# EAGLE schematic Light2021 (EAGLE 9.6.2)
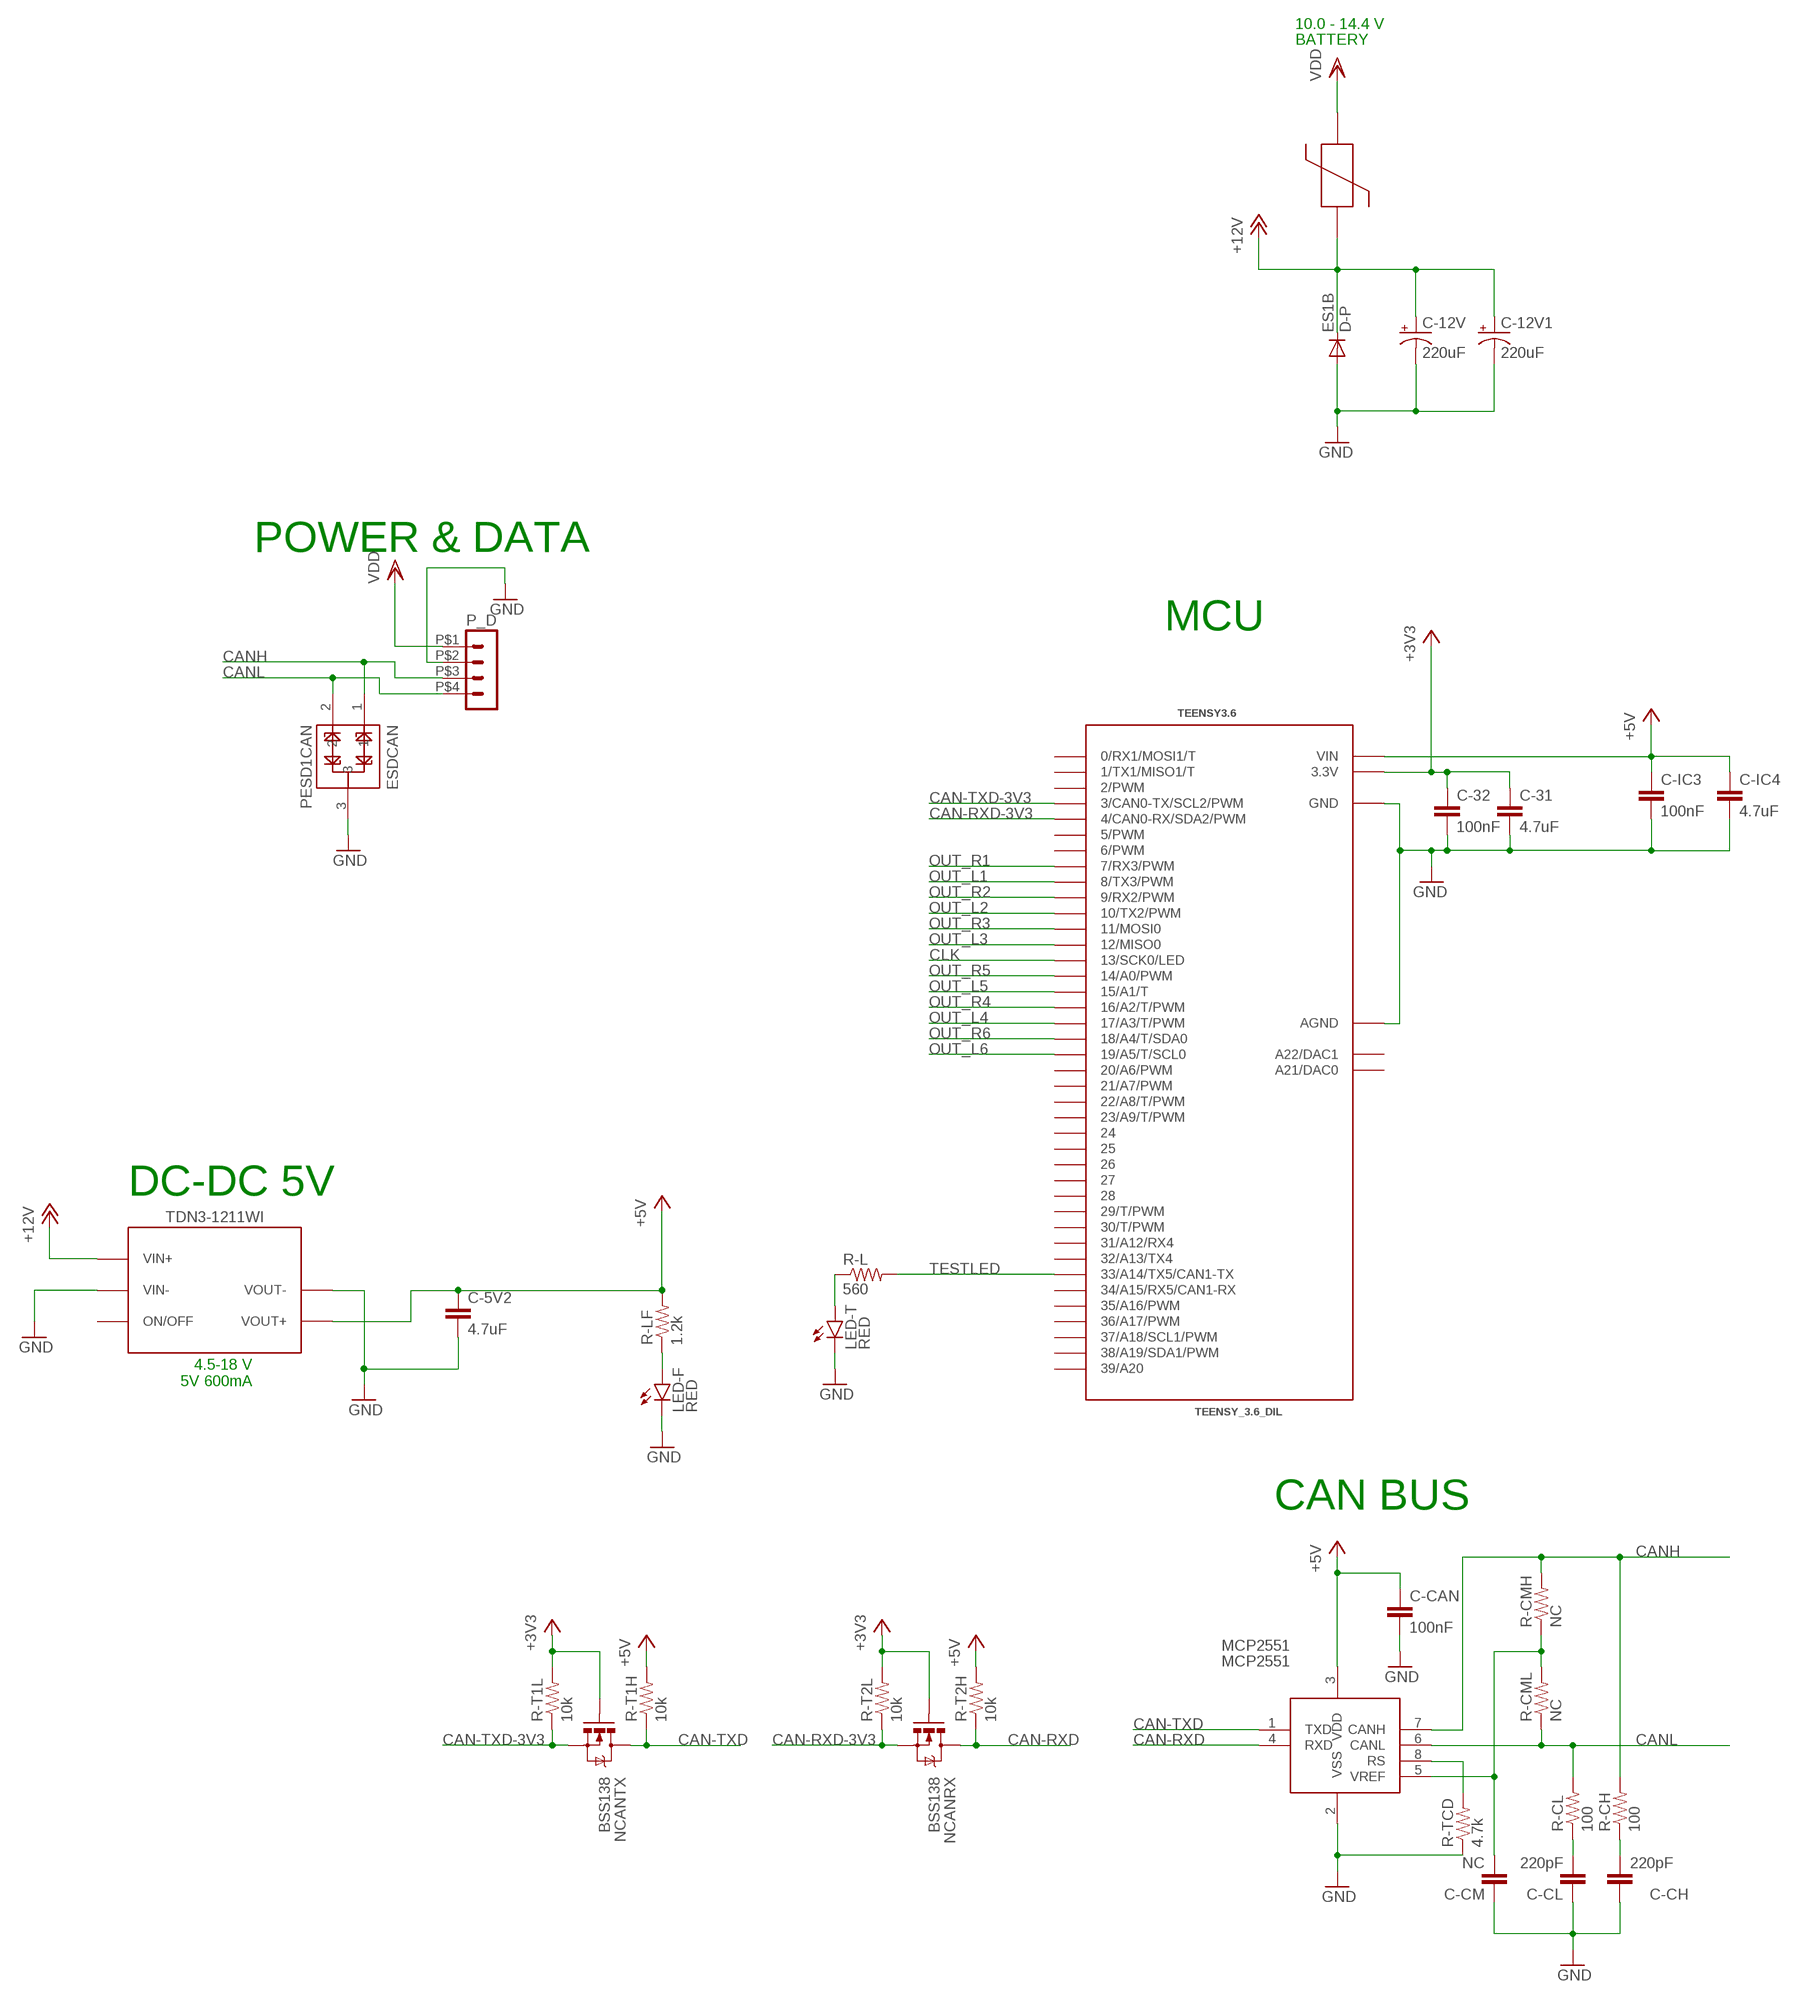
[diagram p0: schematic, sheet 1, part 1 of 2]
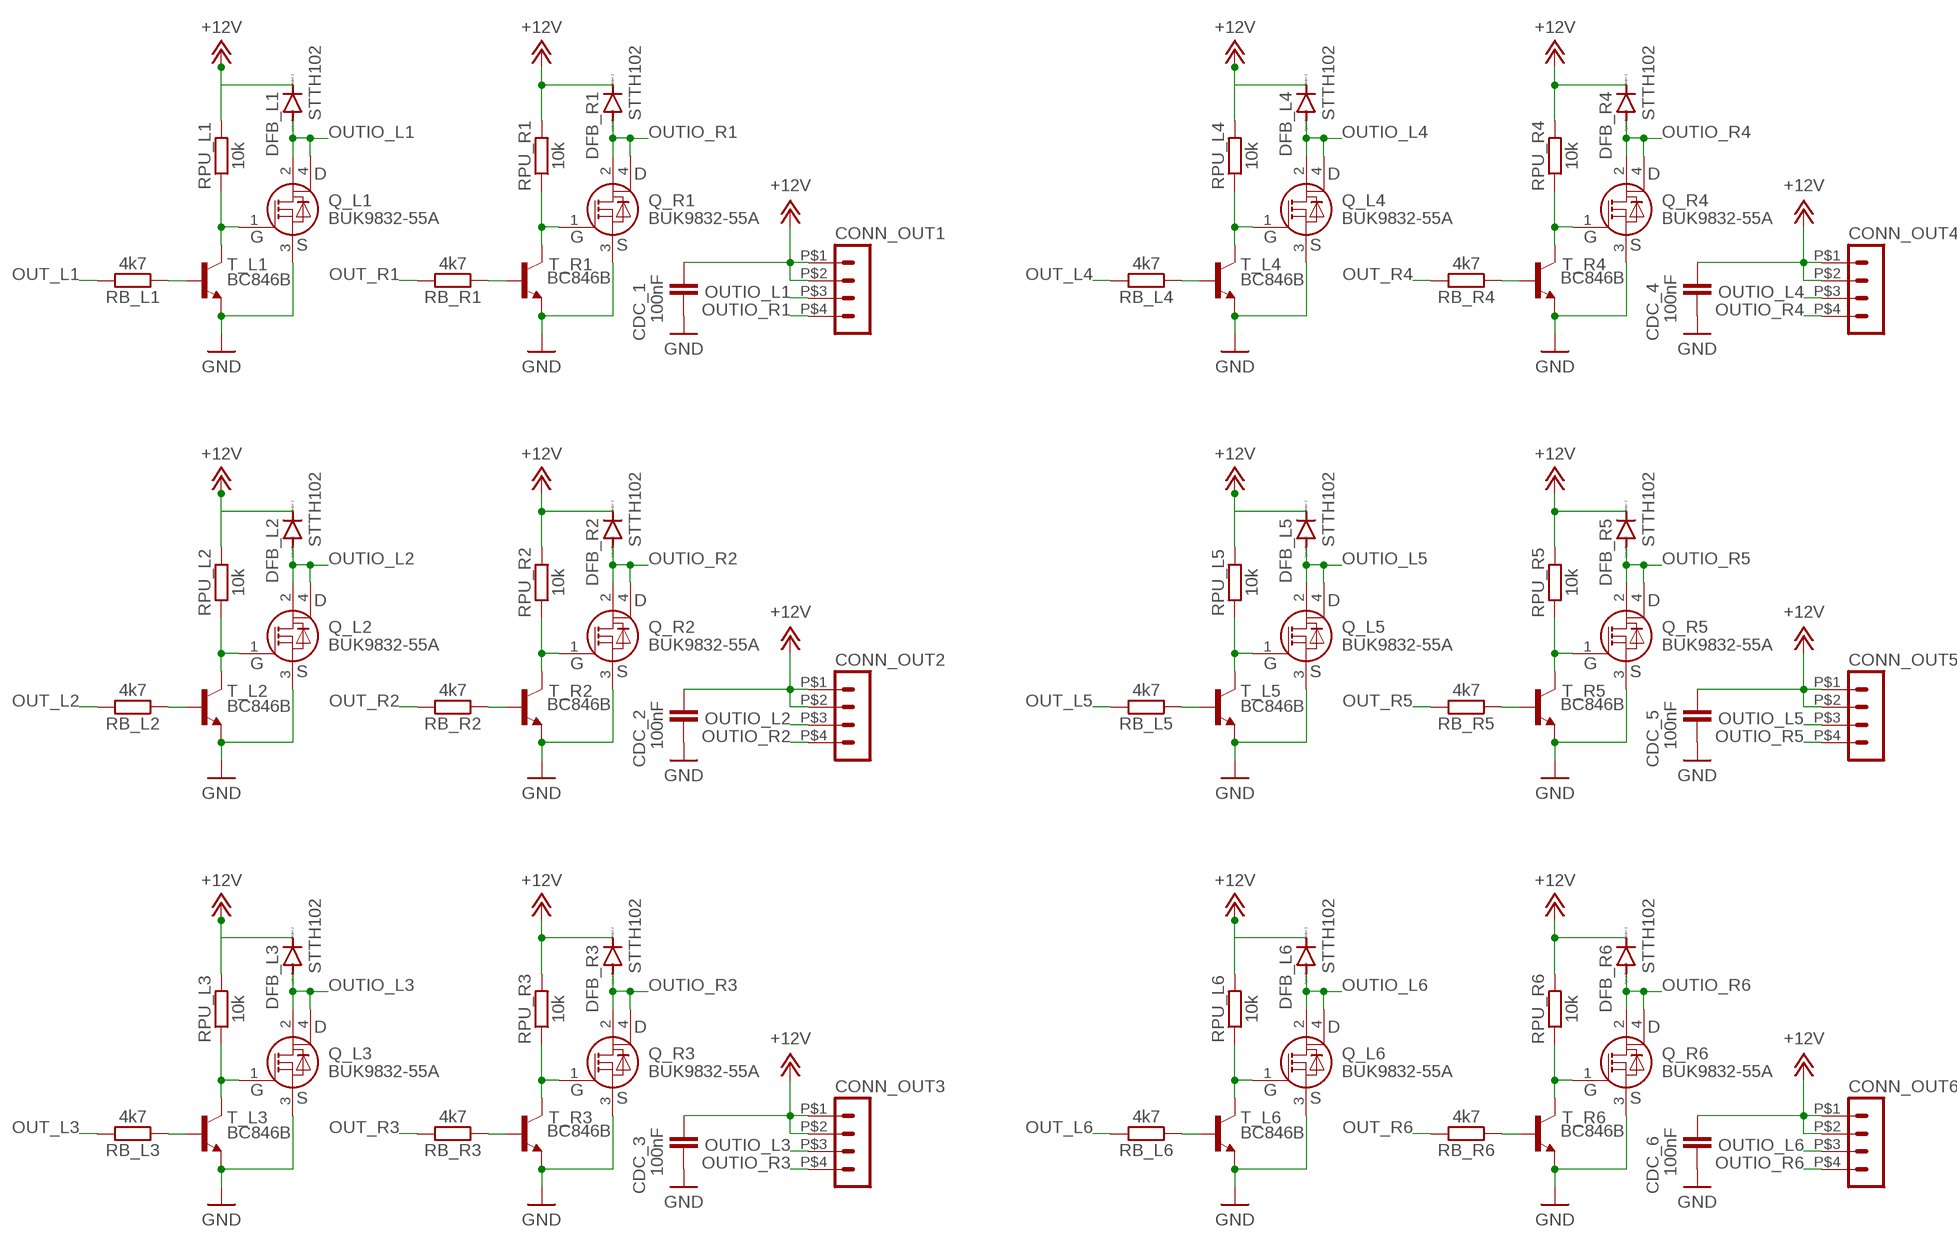
[diagram p1: schematic, sheet 1, part 2 of 2]

## Parts
C-5V2  4.7uF  CAP1210  [1210]
C-12V  220uF  CPOL-USD  [PANASONIC_D]
C-12V1  220uF  CPOL-USD  [PANASONIC_D]
C-31  4.7uF  CAP1210  [1210]
C-32  100nF  CAP0805  [0805]
C-CAN  100nF  CAP0805  [0805]
C-CH  220pF  CAP0805  [0805]
C-CL  220pF  CAP0805  [0805]
C-CM  NC  CAP0805  [0805]
C-IC3  100nF  CAP0805  [0805]
C-IC4  4.7uF  CAP1210  [1210]
CDC_1  100nF  CAP0805  [0805]
CDC_2  100nF  CAP0805  [0805]
CDC_3  100nF  CAP0805  [0805]
CDC_4  100nF  CAP0805  [0805]
CDC_5  100nF  CAP0805  [0805]
CDC_6  100nF  CAP0805  [0805]
CONN_OUT1  HEADER_POS4_43045-0401  [43045-0400]
CONN_OUT2  HEADER_POS4_43045-0401  [43045-0400]
CONN_OUT3  HEADER_POS4_43045-0401  [43045-0400]
CONN_OUT4  HEADER_POS4_43045-0401  [43045-0400]
CONN_OUT5  HEADER_POS4_43045-0401  [43045-0400]
CONN_OUT6  HEADER_POS4_43045-0401  [43045-0400]
D-P  ES1B  DIODESMA  [SMA-DIODE]
DFB_L1  STTH102  DIODE-DO214AC  [DO214AC]
DFB_L2  STTH102  DIODE-DO214AC  [DO214AC]
DFB_L3  STTH102  DIODE-DO214AC  [DO214AC]
DFB_L4  STTH102  DIODE-DO214AC  [DO214AC]
DFB_L5  STTH102  DIODE-DO214AC  [DO214AC]
DFB_L6  STTH102  DIODE-DO214AC  [DO214AC]
DFB_R1  STTH102  DIODE-DO214AC  [DO214AC]
DFB_R2  STTH102  DIODE-DO214AC  [DO214AC]
DFB_R3  STTH102  DIODE-DO214AC  [DO214AC]
DFB_R4  STTH102  DIODE-DO214AC  [DO214AC]
DFB_R5  STTH102  DIODE-DO214AC  [DO214AC]
DFB_R6  STTH102  DIODE-DO214AC  [DO214AC]
ESDCAN  PESD1CAN  [SOT23-3]
LED-F  RED  LED1206  [LED-1206]
LED-T  RED  LED1206  [LED-1206]
MAIN_FUSE  SMF_OMNI-BLOK_FUSE_BLOCK  [SMF_OMNI-BLOK_FUSE_BLOCK]
MCP2551  MCP2551  [SO-08M]
NCANRX  BSS138  MOSFET-NCHANNELBSS123LT1G  [SOT23]
NCANTX  BSS138  MOSFET-NCHANNELBSS123LT1G  [SOT23]
P_D  HEADER_POS4_43045-0401  [43045-0400]
Q_L1  BUK9832-55A  [SOT230P700X180-4N]
Q_L2  BUK9832-55A  [SOT230P700X180-4N]
Q_L3  BUK9832-55A  [SOT230P700X180-4N]
Q_L4  BUK9832-55A  [SOT230P700X180-4N]
Q_L5  BUK9832-55A  [SOT230P700X180-4N]
Q_L6  BUK9832-55A  [SOT230P700X180-4N]
Q_R1  BUK9832-55A  [SOT230P700X180-4N]
Q_R2  BUK9832-55A  [SOT230P700X180-4N]
Q_R3  BUK9832-55A  [SOT230P700X180-4N]
Q_R4  BUK9832-55A  [SOT230P700X180-4N]
Q_R5  BUK9832-55A  [SOT230P700X180-4N]
Q_R6  BUK9832-55A  [SOT230P700X180-4N]
R-CH  100  RESISTOR0805  [0805]
R-CL  100  RESISTOR0805  [0805]
R-CMH  NC  RESISTOR0805  [0805]
R-CML  NC  RESISTOR0805  [0805]
R-L  560  RESISTOR0805  [0805]
R-LF  1.2k  RESISTOR0805  [0805]
R-T1H  10k  RESISTOR0805  [0805]
R-T1L  10k  RESISTOR0805  [0805]
R-T2H  10k  RESISTOR0805  [0805]
R-T2L  10k  RESISTOR0805  [0805]
R-TCD  4.7k  RESISTOR0805  [0805]
RB_L1  4k7  R-EU_R0805  [R0805]
RB_L2  4k7  R-EU_R0805  [R0805]
RB_L3  4k7  R-EU_R0805  [R0805]
RB_L4  4k7  R-EU_R0805  [R0805]
RB_L5  4k7  R-EU_R0805  [R0805]
RB_L6  4k7  R-EU_R0805  [R0805]
RB_R1  4k7  R-EU_R0805  [R0805]
RB_R2  4k7  R-EU_R0805  [R0805]
RB_R3  4k7  R-EU_R0805  [R0805]
RB_R4  4k7  R-EU_R0805  [R0805]
RB_R5  4k7  R-EU_R0805  [R0805]
RB_R6  4k7  R-EU_R0805  [R0805]
RPU_L1  10k  R-EU_R0805  [R0805]
RPU_L2  10k  R-EU_R0805  [R0805]
RPU_L3  10k  R-EU_R0805  [R0805]
RPU_L4  10k  R-EU_R0805  [R0805]
RPU_L5  10k  R-EU_R0805  [R0805]
RPU_L6  10k  R-EU_R0805  [R0805]
RPU_R1  10k  R-EU_R0805  [R0805]
RPU_R2  10k  R-EU_R0805  [R0805]
RPU_R3  10k  R-EU_R0805  [R0805]
RPU_R4  10k  R-EU_R0805  [R0805]
RPU_R5  10k  R-EU_R0805  [R0805]
RPU_R6  10k  R-EU_R0805  [R0805]
T_L1  BC846B  BC846B-NPN-SOT23-BEC  [SOT23-BEC]
T_L2  BC846B  BC846B-NPN-SOT23-BEC  [SOT23-BEC]
T_L3  BC846B  BC846B-NPN-SOT23-BEC  [SOT23-BEC]
T_L4  BC846B  BC846B-NPN-SOT23-BEC  [SOT23-BEC]
T_L5  BC846B  BC846B-NPN-SOT23-BEC  [SOT23-BEC]
T_L6  BC846B  BC846B-NPN-SOT23-BEC  [SOT23-BEC]
T_R1  BC846B  BC846B-NPN-SOT23-BEC  [SOT23-BEC]
T_R2  BC846B  BC846B-NPN-SOT23-BEC  [SOT23-BEC]
T_R3  BC846B  BC846B-NPN-SOT23-BEC  [SOT23-BEC]
T_R4  BC846B  BC846B-NPN-SOT23-BEC  [SOT23-BEC]
T_R5  BC846B  BC846B-NPN-SOT23-BEC  [SOT23-BEC]
T_R6  BC846B  BC846B-NPN-SOT23-BEC  [SOT23-BEC]
TDN3-1211WI  TDN3WI  [TDC3WI]
TEENSY3.6  TEENSY_3.6_DIL  [TEENSY_3.6_DIL]

## Nets
+3V3: C-31.1 C-32.1 NCANRX.1(G) NCANTX.1(G) R-T1L.2 R-T2L.2 TEENSY3.6.3.3V1(3.3V) TEENSY3.6.3.3V2(3.3V)
+5V: C-5V2.1 C-CAN.1 C-IC3.1 C-IC4.1 MCP2551.3(VDD) R-LF.2 R-T1H.2 R-T2H.2 TDN3-1211WI.VOUT+ TEENSY3.6.VIN
+12V: C-12V1.+ C-12V.+ CDC_1.1 CDC_2.1 CDC_3.1 CDC_4.1 CDC_5.1 CDC_6.1 CONN_OUT1.P$1 CONN_OUT1.P$2 CONN_OUT2.P$1 CONN_OUT2.P$2 CONN_OUT3.P$1 CONN_OUT3.P$2 CONN_OUT4.P$1 CONN_OUT4.P$2 CONN_OUT5.P$1 CONN_OUT5.P$2 CONN_OUT6.P$1 CONN_OUT6.P$2 D-P.C DFB_L1.C DFB_L2.C DFB_L3.C DFB_L4.C DFB_L5.C DFB_L6.C DFB_R1.C DFB_R2.C DFB_R3.C DFB_R4.C DFB_R5.C DFB_R6.C MAIN_FUSE.PIN1 RPU_L1.2 RPU_L2.2 RPU_L3.2 RPU_L4.2 RPU_L5.2 RPU_L6.2 RPU_R1.2 RPU_R2.2 RPU_R3.2 RPU_R4.2 RPU_R5.2 RPU_R6.2 TDN3-1211WI.VIN+
CAN-RXD: MCP2551.4(RXD) NCANRX.3(D) R-T2H.1
CAN-RXD-3V3: NCANRX.2(S) R-T2L.1 TEENSY3.6.4(4/CAN0-RX/SDA2/PWM)
CAN-TXD: MCP2551.1(TXD) NCANTX.3(D) R-T1H.1
CAN-TXD-3V3: NCANTX.2(S) R-T1L.1 TEENSY3.6.3(3/CAN0-TX/SCL2/PWM)
CANH [diff_pairs]: ESDCAN.1 MCP2551.7(CANH) P_D.P$3 R-CH.2 R-CMH.2
CANL [diff_pairs]: ESDCAN.2 MCP2551.6(CANL) P_D.P$4 R-CL.2 R-CML.1
CLK: TEENSY3.6.13(13/SCK0/LED)
GND: C-5V2.2 C-12V1.- C-12V.- C-31.2 C-32.2 C-CAN.2 C-CH.1 C-CL.1 C-CM.1 C-IC3.2 C-IC4.2 CDC_1.2 CDC_2.2 CDC_3.2 CDC_4.2 CDC_5.2 CDC_6.2 D-P.A ESDCAN.3 LED-F.C LED-T.C MCP2551.2(VSS) P_D.P$2 Q_L1.3(S) Q_L2.3(S) Q_L3.3(S) Q_L4.3(S) Q_L5.3(S) Q_L6.3(S) Q_R1.3(S) Q_R2.3(S) Q_R3.3(S) Q_R4.3(S) Q_R5.3(S) Q_R6.3(S) R-TCD.1 T_L1.E T_L2.E T_L3.E T_L4.E T_L5.E T_L6.E T_R1.E T_R2.E T_R3.E T_R4.E T_R5.E T_R6.E TDN3-1211WI.VIN- TDN3-1211WI.VOUT- TEENSY3.6.AGND TEENSY3.6.GND TEENSY3.6.GND1(GND)
N$1: LED-T.A R-L.1
N$6: C-CM.2 MCP2551.5(VREF) R-CMH.1 R-CML.2
N$7: RB_L1.1 T_L1.B
N$8: Q_L1.1(G) RPU_L1.1 T_L1.C
N$9: RB_R1.1 T_R1.B
N$10: Q_R1.1(G) RPU_R1.1 T_R1.C
N$11: RB_L2.1 T_L2.B
N$12: LED-F.A R-LF.1
N$13: Q_L2.1(G) RPU_L2.1 T_L2.C
N$14: RB_R2.1 T_R2.B
N$15: Q_R2.1(G) RPU_R2.1 T_R2.C
N$16: RB_L3.1 T_L3.B
N$17: Q_L3.1(G) RPU_L3.1 T_L3.C
N$18: RB_R3.1 T_R3.B
N$19: Q_R3.1(G) RPU_R3.1 T_R3.C
N$24: RB_L4.1 T_L4.B
N$25: C-CL.2 R-CL.1
N$26: C-CH.2 R-CH.1
N$27: Q_L4.1(G) RPU_L4.1 T_L4.C
N$28: RB_R4.1 T_R4.B
N$29: Q_R4.1(G) RPU_R4.1 T_R4.C
N$34: RB_L5.1 T_L5.B
N$35: Q_L5.1(G) RPU_L5.1 T_L5.C
N$36: RB_R5.1 T_R5.B
N$37: Q_R5.1(G) RPU_R5.1 T_R5.C
N$42: RB_L6.1 T_L6.B
N$43: Q_L6.1(G) RPU_L6.1 T_L6.C
N$44: RB_R6.1 T_R6.B
N$45: Q_R6.1(G) RPU_R6.1 T_R6.C
OUT_L1: RB_L1.2 TEENSY3.6.8(8/TX3/PWM)
OUT_L2: RB_L2.2 TEENSY3.6.10(10/TX2/PWM)
OUT_L3: RB_L3.2 TEENSY3.6.12(12/MISO0)
OUT_L4: RB_L4.2 TEENSY3.6.17/A3(17/A3/T/PWM)
OUT_L5: RB_L5.2 TEENSY3.6.15/A1(15/A1/T)
OUT_L6: RB_L6.2 TEENSY3.6.19/A5(19/A5/T/SCL0)
OUT_R1: RB_R1.2 TEENSY3.6.7(7/RX3/PWM)
OUT_R2: RB_R2.2 TEENSY3.6.9(9/RX2/PWM)
OUT_R3: RB_R3.2 TEENSY3.6.11(11/MOSI0)
OUT_R4: RB_R4.2 TEENSY3.6.16/A2(16/A2/T/PWM)
OUT_R5: RB_R5.2 TEENSY3.6.14/A0(14/A0/PWM)
OUT_R6: RB_R6.2 TEENSY3.6.18/A4(18/A4/T/SDA0)
OUTIO_L1: CONN_OUT1.P$3 DFB_L1.A Q_L1.2(D) Q_L1.4(D)
OUTIO_L2: CONN_OUT2.P$3 DFB_L2.A Q_L2.2(D) Q_L2.4(D)
OUTIO_L3: CONN_OUT3.P$3 DFB_L3.A Q_L3.2(D) Q_L3.4(D)
OUTIO_L4: CONN_OUT4.P$3 DFB_L4.A Q_L4.2(D) Q_L4.4(D)
OUTIO_L5: CONN_OUT5.P$3 DFB_L5.A Q_L5.2(D) Q_L5.4(D)
OUTIO_L6: CONN_OUT6.P$3 DFB_L6.A Q_L6.2(D) Q_L6.4(D)
OUTIO_R1: CONN_OUT1.P$4 DFB_R1.A Q_R1.2(D) Q_R1.4(D)
OUTIO_R2: CONN_OUT2.P$4 DFB_R2.A Q_R2.2(D) Q_R2.4(D)
OUTIO_R3: CONN_OUT3.P$4 DFB_R3.A Q_R3.2(D) Q_R3.4(D)
OUTIO_R4: CONN_OUT4.P$4 DFB_R4.A Q_R4.2(D) Q_R4.4(D)
OUTIO_R5: CONN_OUT5.P$4 DFB_R5.A Q_R5.2(D) Q_R5.4(D)
OUTIO_R6: CONN_OUT6.P$4 DFB_R6.A Q_R6.2(D) Q_R6.4(D)
RS: MCP2551.8(RS) R-TCD.2
TESTLED: R-L.2 TEENSY3.6.33/A14(33/A14/TX5/CAN1-TX)
VDD: MAIN_FUSE.PIN2 P_D.P$1
Unconnected: TDN3-1211WI.ONOFF(ON/OFF) TEENSY3.6.0(0/RX1/MOSI1/T) TEENSY3.6.1(1/TX1/MISO1/T) TEENSY3.6.2(2/PWM) TEENSY3.6.5(5/PWM) TEENSY3.6.6(6/PWM) TEENSY3.6.20/A6(20/A6/PWM) TEENSY3.6.21/A7(21/A7/PWM) TEENSY3.6.22/A8(22/A8/T/PWM) TEENSY3.6.23/A9(23/A9/T/PWM) TEENSY3.6.24 TEENSY3.6.25 TEENSY3.6.26 TEENSY3.6.27 TEENSY3.6.28 TEENSY3.6.29(29/T/PWM) TEENSY3.6.30(30/T/PWM) TEENSY3.6.31/A12(31/A12/RX4) TEENSY3.6.32/A13(32/A13/TX4) TEENSY3.6.34/A15(34/A15/RX5/CAN1-RX) TEENSY3.6.35/A16(35/A16/PWM) TEENSY3.6.36/A17(36/A17/PWM) TEENSY3.6.37/A18(37/A18/SCL1/PWM) TEENSY3.6.38/A19(38/A19/SDA1/PWM) TEENSY3.6.39/A20 TEENSY3.6.A21(A21/DAC0) TEENSY3.6.A22(A22/DAC1)

## Notes on the sheet
- 10.0 - 14.4 V
- BATTERY
- POWER & DATA
- MCU
- DC-DC 5V
- 4.5-18 V
  5V 600mA
- CAN BUS

## Library data of the parts
C-5V2 C-31 C-32 C-CAN C-CH C-CL C-CM C-IC3 C-IC4 CDC_1-CDC_6 = SparkFun-Passives:CAP: Capacitor Standard 0603 ceramic capacitor, and 0.1" leaded capacitor.
C-12V C-12V1 = rcl:CPOL-US: POLARIZED CAPACITOR, American symbol
CONN_OUT1-CONN_OUT6 P_D = con-molex-micro-fit-3_0:HEADER_POS4_?: Molex - Micro-Fit 3.0 Series connector, 3.00mm (0.118") pitch header, 4 positions.
D-P = SparkFun-DiscreteSemi:DIODE: Diode These are standard reverse protection diodes and small signal diodes. SMA package can handle up to about 1A. SOD-323 can handle about 200mA. What the SOD-323 package when ordering, there are some mfgs out there that are 5-pin packages.
DFB_L1-DFB_L6 DFB_R1-DFB_R6 = diode:DIODE-: DIODE
ESDCAN = SparkFun-DiscreteSemi:PESD1CAN: PESD1CAN is used to protect two automotive CAN bus lines from ESD.; PROD_ID: DIO-12501
LED-F LED-T = SparkFun-LED:LED: LED (Generic) Standard schematic elements and footprints for 5mm, 3mm, 1206, and 0603 sized LEDs. Generic LEDs with no color specified.
MAIN_FUSE = SMF_OMNI-BLOK_FUSE_BLOCK:SMF_OMNI-BLOK_FUSE_BLOCK
MCP2551 = skpang_lib:MCP2551
NCANRX NCANTX = SparkFun-DiscreteSemi:MOSFET-NCHANNEL: Common NMOSFET Parts MFG P/N Store ID Prod ID FDD8780 TRANS-09984 SI7820DN TRANS-11055 FDS6630A IC-08089 2N7002PW TRANS-11151 FQP30N06L COM-10213 TRANS-10060 BSS123LT1G TRANS-08345 BSS138 TRANS-00830 BS170 2N7000; PROD_ID: TRANS-08345
Q_L1-Q_L6 Q_R1-Q_R6 = custom:BUK9832-55A: MOSFET N-channel TrenchMOS logic level FET Source: Datasheet <https://assets.nexperia.com/documents/data-sheet/BUK9832-55A.pdf>; DESCRIPTION: MOSFET N-channel TrenchMOS logic level FET; HEIGHT: 1.8mm; MANUFACTURER_NAME: Nexperia; MANUFACTURER_PART_NUMBER: BUK9832-55A/CUX; MOUSER_PART_NUMBER: 771-BUK9832-55A/CUX; MOUSER_PRICE-STOCK: https://www.mouser.co.uk/ProductDetail/Nexperia/BUK9832-55A-CUX?qs=Yna0arPQ0CQmqEEmts1kDA%3D%3D
R-CH R-CL R-CMH R-CML R-L R-LF R-T1H R-T1L R-T2H R-T2L R-TCD = SparkFun-Resistors:RESISTOR: Generic Resistor Package
RB_L1-RB_L6 RB_R1-RB_R6 RPU_L1-RPU_L6 RPU_R1-RPU_R6 = rcl:R-EU_: RESISTOR, European symbol; SPICEPREFIX: R
T_L1-T_L6 T_R1-T_R6 = transistor:*-NPN-: NPN Transistror BF959 corrected 2008.03.06
TDN3-1211WI = TracoTDN3WI:TDN3WI
TEENSY3.6 = Teensy_3_and_LC_Series_Boards_v1.4:TEENSY_3.6_DIL: Teensy 3.6 DIL Package

## Net classes
1 diff_pairs: width 0.406 mm